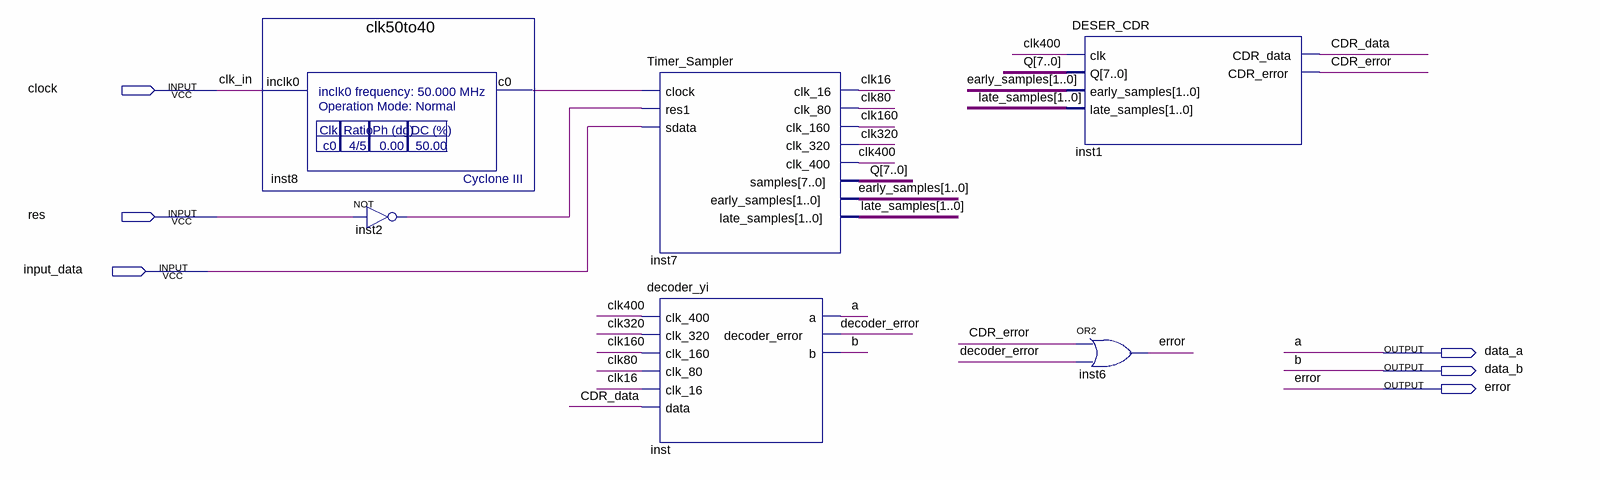
[diagram p0: schematic sheet]
// Quartus schematic DESER400.bdf as structural Verilog: 6 symbols, 6 pins
module DESER400 (
  input  clock,
  input  res,
  input  input_data,
  output data_a,
  output data_b,
  output error
);

  wire CDR_data, CDR_error, clk16, clk80, clk160, clk320, clk400, decoder_error, inst2_out, inst8_c0;
  wire [1:0] early_samples, late_samples;
  wire [7:0] Q;

  clk50to40 inst8 (.inclk0(clock), .c0(inst8_c0));
  not inst2 (inst2_out, res);
  Timer_Sampler inst7 (
    .clock(inst8_c0), .res1(inst2_out), .sdata(input_data), .clk_16(clk16), .clk_80(clk80), .clk_160(clk160),
    .clk_320(clk320), .clk_400(clk400), .samples(Q), .early_samples(early_samples),
    .late_samples(late_samples));
  decoder_yi inst (
    .clk_400(clk400), .clk_320(clk320), .clk_160(clk160), .clk_80(clk80), .clk_16(clk16), .data(CDR_data),
    .a(data_a), .decoder_error(decoder_error), .b(data_b));
  DESER_CDR inst1 (
    .clk(clk400), .Q(Q), .early_samples(early_samples), .late_samples(late_samples), .CDR_data(CDR_data),
    .CDR_error(CDR_error));
  or inst6 (error, CDR_error, decoder_error);

  // Other names for the same wires on the sheet: a = data_a; b = data_b; clk_in = clock
endmodule
